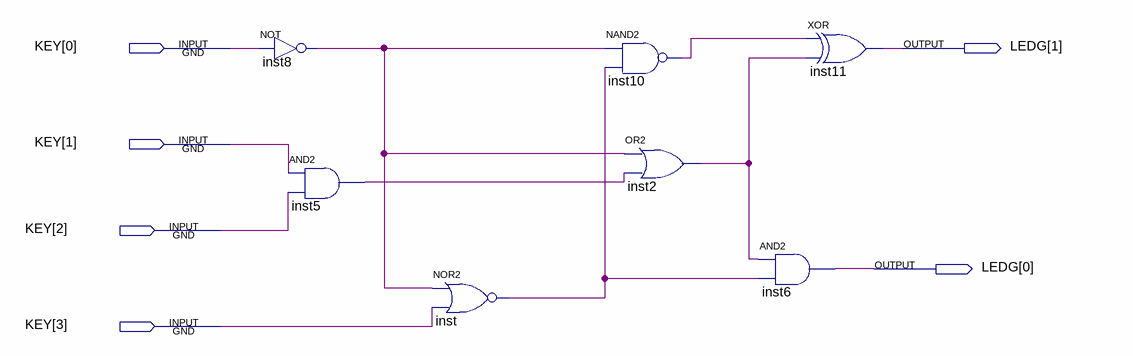
[diagram p0: schematic sheet]
// Quartus schematic DOUGLAS.bdf as structural Verilog: 7 symbols, 6 pins
module DOUGLAS (
  input  [3:0] KEY,
  output [1:0] LEDG
);

  wire inst2_out, inst5_out, inst8_out, inst10_out, inst_out;

  not inst8 (inst8_out, KEY[0]);
  and inst5 (inst5_out, KEY[1], KEY[2]);
  nor inst (inst_out, inst8_out, KEY[3]);
  nand inst10 (inst10_out, inst8_out, inst_out);
  or inst2 (inst2_out, inst8_out, inst5_out);
  and inst6 (LEDG[0], inst2_out, inst_out);
  xor inst11 (LEDG[1], inst10_out, inst2_out);
endmodule
